# Altium schematic sheet STM32.SchDoc
size A3; Author: Liu Hao; Organization: USTC; Address1: HuangShan Road; Address2: He Fei; Address3: An Hui; Address4: China; Revision: V1.0; SheetNumber: 1/1
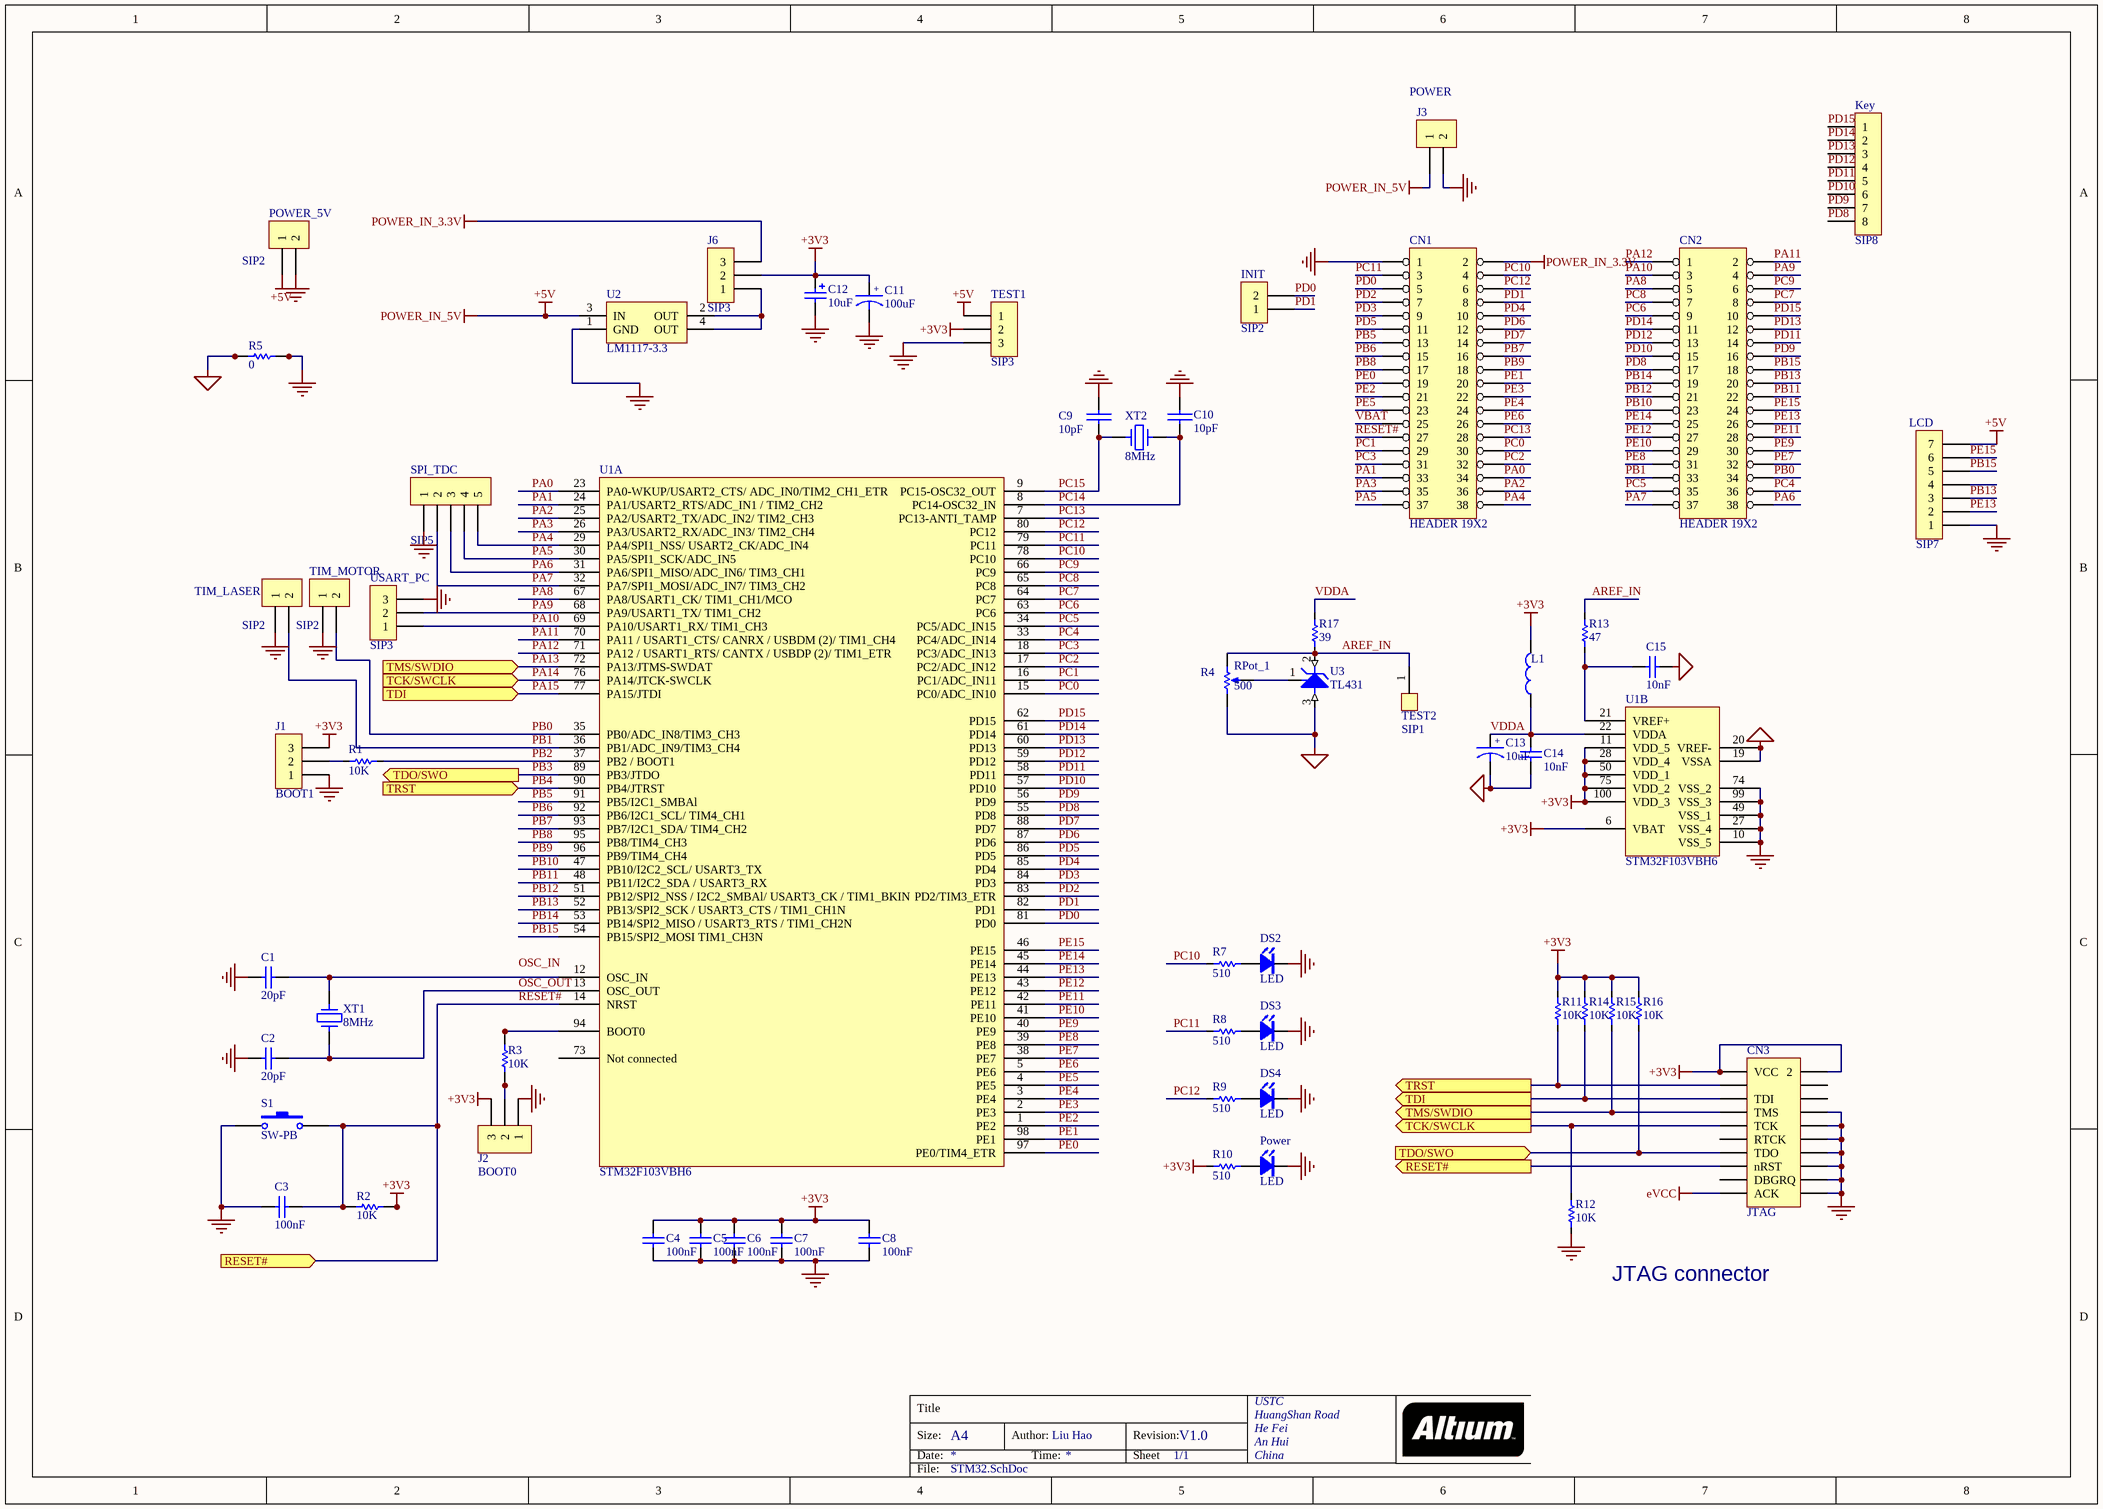
[diagram p0: STM32.SchDoc]

## Parts
C1  20pF  [0805C]
C2  20pF  [0805C]
C3  100nF  [0805C]
C4  100nF  [0805C]
C5  100nF  [0805C]
C6  100nF  [0805C]
C7  100nF  [0805C]
C8  100nF  [0805C]
C9  10pF  [0805C]
C10  10pF  [0805C]
C11  100uF  [3528C(1210)]
C12  10uF  [0805C]
C13  10uF  [3528C(1210)]
C14  10nF  [0805C]
C15  10nF  [0805C]
CN1  HEADER 19X2  [DIP38]
CN2  HEADER 19X2  [DIP38]
CN3  JTAG  [IDC20_W]
DS2  LED  [0805D]
DS3  LED  [0805D]
DS4  LED  [0805D]
INIT  SIP2  [SIP2-2.54]
J1  BOOT1  [SIP3-2.54]
J2  BOOT0  [SIP3-2.54]
J3  POWER  [SIP2-2.54]
J6  SIP3  [SIP3-2.54]
Key  SIP8  [SIP8-2.54]
L1  (no value)  [0805R]
LCD  SIP7  [SIP7-2.54]
Power  LED  [0805D]
POWER_5V  SIP2  [SIP2-2.54]
R1  10K  [0805R]
R2  10K  [0805R]
R3  10K  [0805R]
R4  RPot_1  value 500  [VR4B]
R5  0  [0805R]
R7  510  [0805R]
R8  510  [0805R]
R9  510  [0805R]
R10  510  [0805R]
R11  10K  [0805R]
R12  10K  [0805R]
R13  47  [0805R]
R14  10K  [0805R]
R15  10K  [0805R]
R16  10K  [0805R]
R17  39  [0805R]
S1  SW-PB  [KEY_4PIN]
SPI_TDC  SIP5  [SIP5-2.54]
TEST1  SIP3  [SIP3-2.54]
TEST2  SIP1  [SIP1]
TIM_LASER  SIP2  [SIP2-2.54]
TIM_MOTOR  SIP2  [SIP2-2.54]
U1  STM32F103VBH6  [LQFP-100]  (parts A,B of 2)
U2  LM1117-3.3  [lm1117]
U3  TL431  [SOT-23]
USART_PC  SIP3  [SIP3-2.54]
XT1  value 8MHz  [HC-49S]  (hidden comment: crastal)
XT2  value 8MHz  [AT38]  (hidden comment: crastal)

## Ports
RESET# (in), RESET# (out), TCK/SWCLK (in), TCK/SWCLK (out), TDI (in), TDI (out), TDO/SWO (in), TDO/SWO (out), TMS/SWDIO (in), TMS/SWDIO (out), TRST (in), TRST (out)

## Nets
+3V3: C4.2 C5.2 C6.2 C7.2 C8.2 C11.1 C12.1 CN3.1(VCC) CN3.2 J1.3 J2.3 J6.2 L1.1 R2.2 R10.1 R11.2 R14.2 R15.2 R16.2 TEST1.2 U1.6(VBAT) U1.11(VDD_5) U1.28(VDD_4) U1.50(VDD_1) U1.75(VDD_2) U1.100(VDD_3)
+5V: J3.1 LCD.7 POWER_5V.1 TEST1.1 U2.3(IN)  [also labelled POWER_IN_5V]
eVCC: CN3.19(ACK)
GND: C1.1 C2.1 C3.1 C4.1 C5.1 C6.1 C7.1 C8.1 C9.2 C10.2 C11.2 C12.2 CN1.1 CN3.8 CN3.10 CN3.12 CN3.14 CN3.16 CN3.18 CN3.20 DS2.K DS3.K DS4.K J1.1 J2.1 J3.2 LCD.1 Power.K POWER_5V.2 R5.1 R12.1 S1.1 SPI_TDC.1 TEST1.3 TIM_LASER.1 TIM_MOTOR.1 U1.10(VSS_5) U1.27(VSS_4) U1.49(VSS_1) U1.74(VSS_2) U1.99(VSS_3) U2.1(GND) USART_PC.3
POWER_IN_3.3V: CN1.2 J6.3
SGND: C13.2 C14.2 C15.2 R4.1(TOP) R5.2 U1.19(VSSA) U1.20(VREF-) U3.3(A)
AREF_IN: R4.2(BOT) R13.2 R17.1 TEST2.1 U3.2(C)
OSC_OUT: C2.2 U1.13(OSC_OUT) XT1.2
PA0: CN1.34 U1.23(PA0-WKUP/USART2_CTS/
ADC_IN0/TIM2_CH1_ETR)
PA1: CN1.33 U1.24(PA1/USART2_RTS/ADC_IN1
/
TIM2_CH2)
PA2: CN1.36 U1.25(PA2/USART2_TX/ADC_IN2/
TIM2_CH3)
PA3: CN1.35 U1.26(PA3/USART2_RX/ADC_IN3/
TIM2_CH4)
PA4: CN1.38 SPI_TDC.5 U1.29(PA4/SPI1_NSS/
USART2_CK/ADC_IN4)
PA5: CN1.37 SPI_TDC.4 U1.30(PA5/SPI1_SCK/ADC_IN5)
PA6: CN2.38 SPI_TDC.3 U1.31(PA6/SPI1_MISO/ADC_IN6/
TIM3_CH1)
PA7: CN2.37 SPI_TDC.2 U1.32(PA7/SPI1_MOSI/ADC_IN7/
TIM3_CH2)
PA8: CN2.5 U1.67(PA8/USART1_CK/
TIM1_CH1/MCO)
PA9: CN2.4 U1.68(PA9/USART1_TX/
TIM1_CH2) USART_PC.2
PA10: CN2.3 U1.69(PA10/USART1_RX/
TIM1_CH3) USART_PC.1
PA11: CN2.2 U1.70(PA11_/_USART1_CTS/
CANRX_/_USBDM_(2)/
TIM1_CH4)
PA12: CN2.1 U1.71(PA12_/_USART1_RTS/
CANTX_/_USBDP_(2)/
TIM1_ETR)
PA13: CN3.7(TMS) R15.1 U1.72(PA13/JTMS-SWDAT) ; port TMS/SWDIO
PA14: CN3.9(TCK) R12.2 U1.76(PA14/JTCK-SWCLK) ; port TCK/SWCLK
PA15: CN3.5(TDI) R14.1 U1.77(PA15/JTDI) ; port TDI
PB0: CN2.34 TIM_MOTOR.2 U1.35(PB0/ADC_IN8/TIM3_CH3)
PB1: CN2.33 TIM_LASER.2 U1.36(PB1/ADC_IN9/TIM3_CH4)
PB2: R1.2 U1.37(PB2_/_BOOT1)
PB3: CN3.13(TDO) R16.1 U1.89(PB3/JTDO) ; port TDO/SWO
PB4: CN3.3 R11.1 U1.90(PB4/JTRST) ; port TRST
PB5: CN1.13 U1.91(PB5/I2C1_SMBAl)
PB6: CN1.15 U1.92(PB6/I2C1_SCL/
TIM4_CH1)
PB7: CN1.16 U1.93(PB7/I2C1_SDA/
TIM4_CH2)
PB8: CN1.17 U1.95(PB8/TIM4_CH3)
PB9: CN1.18 U1.96(PB9/TIM4_CH4)
PB10: CN2.23 U1.47(PB10/I2C2_SCL/
USART3_TX)
PB11: CN2.22 U1.48(PB11/I2C2_SDA_/
USART3_RX)
PB12: CN2.21 U1.51(PB12/SPI2_NSS_/
I2C2_SMBAl/
USART3_CK_/
TIM1_BKIN)
PB13: CN2.20 LCD.3 U1.52(PB13/SPI2_SCK_/
USART3_CTS_/
TIM1_CH1N)
PB14: CN2.19 U1.53(PB14/SPI2_MISO_/
USART3_RTS_/
TIM1_CH2N)
PB15: CN2.18 LCD.5 U1.54(PB15/SPI2_MOSI
TIM1_CH3N)
PC0: CN1.30 U1.15(PC0/ADC_IN10)
PC1: CN1.29 U1.16(PC1/ADC_IN11)
PC2: CN1.32 U1.17(PC2/ADC_IN12)
PC3: CN1.31 U1.18(PC3/ADC_IN13)
PC4: CN2.36 U1.33(PC4/ADC_IN14)
PC5: CN2.35 U1.34(PC5/ADC_IN15)
PC6: CN2.9 U1.63(PC6)
PC7: CN2.8 U1.64(PC7)
PC8: CN2.7 U1.65(PC8)
PC9: CN2.6 U1.66(PC9)
PC10: CN1.4 R7.1 U1.78(PC10)
PC11: CN1.3 R8.1 U1.79(PC11)
PC12: CN1.6 R9.1 U1.80(PC12)
PC13: CN1.28 U1.7(PC13-ANTI_TAMP)
PC14: C10.1 U1.8(PC14-OSC32_IN) XT2.2
PC15: C9.1 U1.9(PC15-OSC32_OUT) XT2.1
PD0: CN1.5 INIT.2 U1.81(PD0)
PD1: CN1.8 INIT.1 U1.82(PD1)
PD2: CN1.7 U1.83(PD2/TIM3_ETR)
PD3: CN1.9 U1.84(PD3)
PD4: CN1.10 U1.85(PD4)
PD5: CN1.11 U1.86(PD5)
PD6: CN1.12 U1.87(PD6)
PD7: CN1.14 U1.88(PD7)
PD8: CN2.17 Key.8 U1.55(PD8)
PD9: CN2.16 Key.7 U1.56(PD9)
PD10: CN2.15 Key.6 U1.57(PD10)
PD11: CN2.14 Key.5 U1.58(PD11)
PD12: CN2.13 Key.4 U1.59(PD12)
PD13: CN2.12 Key.3 U1.60(PD13)
PD14: CN2.11 Key.2 U1.61(PD14)
PD15: CN2.10 Key.1 U1.62(PD15)
PE0: CN1.19 U1.97(PE0/TIM4_ETR)
PE1: CN1.20 U1.98(PE1)
PE2: CN1.21 U1.1(PE2)
PE3: CN1.22 U1.2(PE3)
PE4: CN1.24 U1.3(PE4)
PE5: CN1.23 U1.4(PE5)
PE6: CN1.26 U1.5(PE6)
PE7: CN2.32 U1.38(PE7)
PE8: CN2.31 U1.39(PE8)
PE9: CN2.30 U1.40(PE9)
PE10: CN2.29 U1.41(PE10)
PE11: CN2.28 U1.42(PE11)
PE12: CN2.27 U1.43(PE12)
PE13: CN2.26 LCD.2 U1.44(PE13)
PE14: CN2.25 U1.45(PE14)
PE15: CN2.24 LCD.6 U1.46(PE15)
RESET#: C3.2 CN1.27 CN3.15(nRST) R2.1 S1.2 U1.14(NRST) ; port RESET#
VBAT: CN1.25
VDDA: C13.1 C14.1 L1.2 R17.2 U1.22(VDDA)
NetC1_2: C1.2 U1.12(OSC_IN) XT1.1
NetC15_1: C15.1 R13.1 U1.21(VREF+)
NetDS2_A: DS2.A R7.2
NetDS3_A: DS3.A R8.2
NetDS4_A: DS4.A R9.2
NetJ1_2: J1.2 R1.1
NetJ2_2: J2.2 R3.2
NetJ6_1: J6.1 U2.2(OUT) U2.4(OUT)
NetPower_A: Power.A R10.2
NetR3_1: R3.1 U1.94(BOOT0)
NetR4_3: R4.3(TAP) U3.1(R)

Not connected (* = marked no-connect by the designer): CN3 4 6 11(RTCK) 17(DBGRQ); LCD 4; U1 73(Not_connected)

## Notes on the sheet
- JTAG connector
- Labels drawn without touching a wire or pin: OSC_IN
- Title
- Size:
- Date:
- A4
- Author:
- Time:
- Revision:
- Sheet
- File:
- (in symbol Cap-T) +

## Library data of the parts
C1-C8 = Cap1: SMD-CAP; PackageReference: 0805C
  C1 C2: Value: 20pF
  C3-C8: Value: 100nF
C9 C10 = CAP: Capacitor
C11 C13 = Cap-T: 钽电容; 耐压: 16V; PackageReference: 3528C
  C11: Value: 100uF
  C13: Value: 10uF
C12 = Cap Pol3: Polarized Capacitor (Surface Mount); Published: *; Publisher: *; Manufacturer: *; Class: *; SubClass: *
C14 C15 = Cap: Capacitor; Published: 8-Jun-2000; Revision: July-2002: Re-released for DXP Platform.; Publisher: Altium Limited; Value: 10nF
CN3 = Header 10X2: Header, 10-Pin, Dual row; Manufacturer: Generic Components; Class: Connector
INIT J3 POWER_5V TIM_LASER TIM_MOTOR = SIP2: jointbar
J1 J2 J6 TEST1 USART_PC = SIP3: jointbar
Key = SIP8: jointbar
L1 = L1
LCD = SIP7: jointbar
R1 R7-R17 = RES Semi: Resistor
  R1 R11 R12 R14-R16: Value: 10K
  R7-R10: Value: 510
  R13: Value: 47
  R17: Value: 39
R2 R3 R5 = res1: Resistor; Value: 1K; Published: 8-Jun-2000; Revision: July-2002: Re-released for DXP Platform.; Publisher: Altium Limited
R4 = RPot_1: Potentiometer; Sim Note: Enter the Resistance value and the set point into parameter fields.; Set Position: 0.5; Published: 8-Jun-2000; LatestRevisionDate: 17-Jul-2002; LatestRevisionNote: Re-released for DXP Platform.; PackageReference: VR5; Publisher: Altium Limited
S1 = SW-PB: Switch; Published: 24-Mar-1999; LatestRevisionDate: 17-Jul-2002; LatestRevisionNote: Re-released for DXP Platform.; PackageReference: SPST-2; Publisher: Altium Limited
SPI_TDC = SIP5: jointbar
TEST2 = SIP1: Variable Resistor; Set Position: 0.5; Published: 8-Jun-2000; LatestRevisionDate: 17-Jul-2002; LatestRevisionNote: Re-released for DXP Platform.; PackageReference: AXIAL-0.6; Publisher: Altium Limited
U2 = LM1117-3.3: 800mA and 1A Low Dropout Positive Regulator 2.85V, 3.3V, 5V, and Adjustable; PackageDocument: revC; Published: 8-Jun-2000; LatestRevisionDate: 17-Jul-2002; LatestRevisionNote: Re-released for DXP Platform.; DatasheetDocument: Sep-1997; PackageReference: ZZ311; Publisher: Altium Limited; ComponentLink1Description: Manufacturer Link; ComponentLink1URL: http://www.ti.com/
U3 = TL431: IC
XT1 XT2 = XT: 晶振